# Altium schematic sheet 显示.SchDoc
size A4
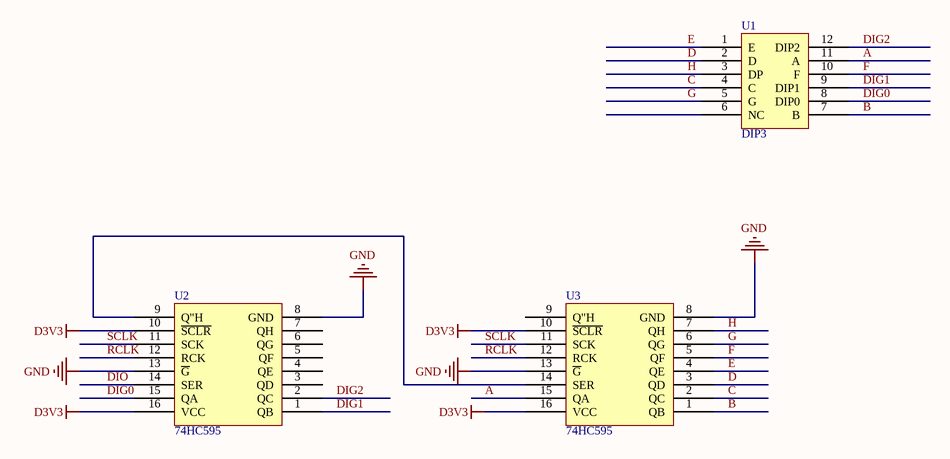
[diagram p0: 显示.SchDoc]

## Parts
U1  DIP3  [DIP3]
U2  74HC595  [LC-SOP-16_150mil]
U3  74HC595  [LC-SOP-16_150mil]

## Nets
D3V3: U2.10(~{SCLR}) U2.16(VCC) U3.10(~{SCLR}) U3.16(VCC)
GND: U2.8(GND) U2.13(~{G}) U3.8(GND) U3.13(~{G})
A: U1.11(A) U3.15(QA)
B: U1.7(B) U3.1(QB)
C: U1.4(C) U3.2(QC)
D: U1.2(D) U3.3(QD)
DIG0: U1.8(DIP0) U2.15(QA)
DIG1: U1.9(DIP1) U2.1(QB)
DIG2: U1.12(DIP2) U2.2(QC)
DIO: U2.14(SER)
E: U1.1(E) U3.4(QE)
F: U1.10(F) U3.5(QF)
G: U1.5(G) U3.6(QG)
H: U1.3(DP) U3.7(QH)
RCLK: U2.12(RCK) U3.12(RCK)
SCLK: U2.11(SCK) U3.11(SCK)
NetU2_9: U2.9(Q"H) U3.14(SER)

Not connected (* = marked no-connect by the designer): U1 6(NC); U2 3(QD) 4(QE) 5(QF) 6(QG) 7(QH); U3 9(Q"H)